# Altium project Earendel_Rules_Enabled_V2.PrjPcb
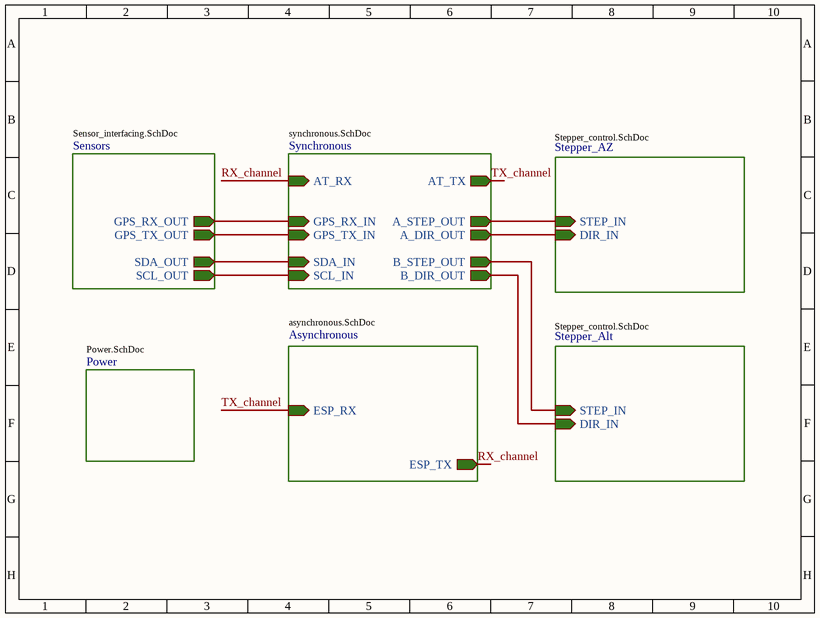
[diagram p0: Top_domain.SchDoc]
6 sheets, 53 parts. Net scope: hierarchical (ports join the sheet entries above them; power ports are global).
Board file: PCBmain.PcbDoc
Sheets:
  Top_domain.SchDoc
    Power = Power.SchDoc
    Synchronous = synchronous.SchDoc
    Asynchronous = asynchronous.SchDoc
    Sensors = Sensor_interfacing.SchDoc
    Stepper_AZ = Stepper_control.SchDoc
    Stepper_Alt = Stepper_control.SchDoc

## Sheet Top_domain.SchDoc
size 152 x 114 mm; SheetNumber: 1; SheetTotal: 5

### Sub-sheets
Asynchronous = asynchronous.SchDoc: ESP_RX (in), ESP_TX (out)
Power = Power.SchDoc: no entries
Sensors = Sensor_interfacing.SchDoc: GPS_RX_OUT (out), GPS_TX_OUT (out), SDA_OUT (out), SCL_OUT (out)
Stepper_Alt = Stepper_control.SchDoc: STEP_IN (in), DIR_IN (in)
Stepper_AZ = Stepper_control.SchDoc: STEP_IN (in), DIR_IN (in)
Synchronous = synchronous.SchDoc: AT_TX (out), AT_RX (in), GPS_RX_IN (in), GPS_TX_IN (in), SDA_IN (in), SCL_IN (in), A_STEP_OUT (out), B_STEP_OUT (out), A_DIR_OUT (out), B_DIR_OUT (out)

### Nets
RX_channel: sheet Synchronous/AT_RX, sheet Asynchronous/ESP_TX
SCL: sheet Synchronous/SCL_IN, sheet Sensors/SCL_OUT
SDA: sheet Synchronous/SDA_IN, sheet Sensors/SDA_OUT
TX_channel: sheet Synchronous/AT_TX, sheet Asynchronous/ESP_RX
NetP1_2: sheet Synchronous/GPS_TX_IN, sheet Sensors/GPS_TX_OUT
NetP1_3: sheet Synchronous/GPS_RX_IN, sheet Sensors/GPS_RX_OUT
NetP2A_7: sheet Synchronous/A_STEP_OUT, sheet Stepper_AZ/STEP_IN
NetP2A_8: sheet Synchronous/A_DIR_OUT, sheet Stepper_AZ/DIR_IN
NetP2B_7: sheet Synchronous/B_STEP_OUT, sheet Stepper_Alt/STEP_IN
NetP2B_8: sheet Synchronous/B_DIR_OUT, sheet Stepper_Alt/DIR_IN

## Sheet Power.SchDoc
size 114 x 152 mm; SheetNumber: 4; SheetTotal: 5
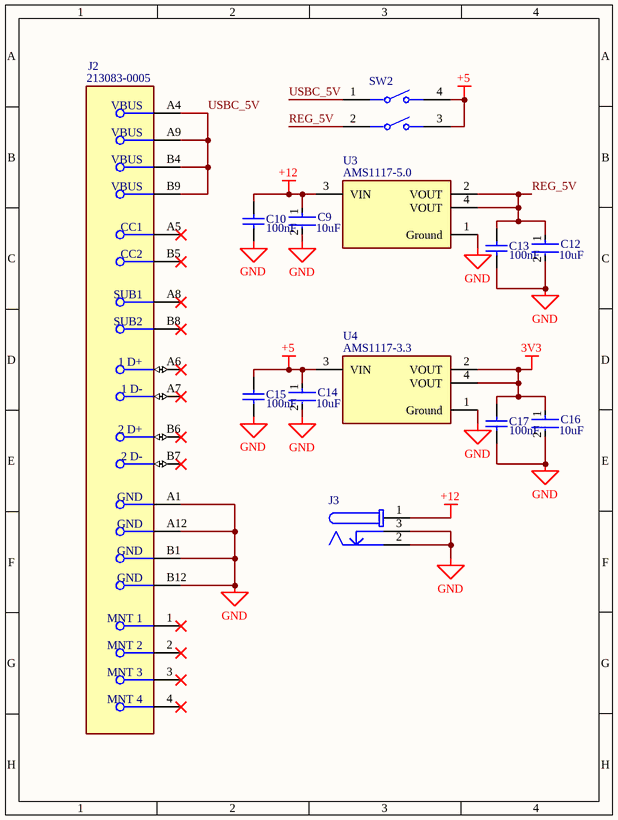
[diagram p1: Power.SchDoc]

### Parts
C9  Capacitance: 10uF  [FP-1206-L_3_2_0_2-W_1_6_0-IPC_B]  (hidden comment: 1206YD106KAT2A)
C10  value 100nF  [CAPC2013X140X50LL20T25]  (hidden comment: 08055F104KAT2A)
C12  Capacitance: 10uF  [FP-1206-L_3_2_0_2-W_1_6_0-IPC_B]  (hidden comment: 1206YD106KAT2A)
C13  value 100nF  [CAPC2013X140X50LL20T25]  (hidden comment: 08055F104KAT2A)
C14  Capacitance: 10uF  [FP-1206-L_3_2_0_2-W_1_6_0-IPC_B]  (hidden comment: 1206YD106KAT2A)
C15  value 100nF  [CAPC2013X140X50LL20T25]  (hidden comment: 08055F104KAT2A)
C16  Capacitance: 10uF  [FP-1206-L_3_2_0_2-W_1_6_0-IPC_B]  (hidden comment: 1206YD106KAT2A)
C17  value 100nF  [CAPC2013X140X50LL20T25]  (hidden comment: 08055F104KAT2A)
J2  213083-0005  [FP-2130830005-MFG]
J3  694106301002  [694106301002]  (value not drawn)
SW2  A6T-2104  [FP-A6T-2104-MFG]  (value not drawn)
U3  AMS1117-5.0  [FP-AMS1117-IPC_C]
U4  AMS1117-3.3  [FP-AMS1117-IPC_C]

### Nets
3V3: C16.1 C17.2 U4.2(VOUT) U4.4(VOUT)
+5: C14.1 C15.2 SW2.3 SW2.4 U4.3(VIN)
+12: C9.1 C10.2 J3.1 U3.3(VIN)
GND: C9.2 C10.1 C12.2 C13.1 C14.2 C15.1 C16.2 C17.1 J2.A1(GND) J2.A12(GND) J2.B1(GND) J2.B12(GND) J3.2 J3.3 U3.1(Ground) U4.1(Ground)
REG_5V: C12.1 C13.2 SW2.2 U3.2(VOUT) U3.4(VOUT)
USBC_5V: J2.A4(VBUS) J2.A9(VBUS) J2.B4(VBUS) J2.B9(VBUS) SW2.1

Not connected (* = marked no-connect by the designer): J2 1(MNT_1)* 2(MNT_2)* 3(MNT_3)* 4(MNT_4)* A5(CC1)* A6(1_D+)* A7(1_D-)* A8(SUB1)* B5(CC2)* B6(2_D+)* B7(2_D-)* B8(SUB2)*

### Library data of the parts
C9 C12 C14 C16 = CMP-04427-000082-1: General Purpose Ceramic Capacitor, 1206, 10uF, 10%, X5R, 15%, 16V; Max Operating Temperature: 85°C; Tolerance: 10%; Dielectric: X5R; Series: -; Case Code (Imperial): 1206; Width: 1.6mm; Termination: SMD/SMT; Voltage Rating: 16V; REACH SVHC: No SVHC; Length: 3.2mm; Size: 1.78mm; Package Quantity: 1; Voltage: 16V; RoHS Compliant: Yes; Thickness: 0.07inch; Mount: Surface Mount; Radiation Hardening: No; Voltage Rating (DC): 16V; Min Operating Temperature: -55°C; Case Code (Metric): 3216; Construction: Flat; Depth: 1.6mm; Height: 0.07mm; Lead Free: Lead Free; Number of Pins: 2; Case/Package: 1206; Packaging: Tape and Reel
C10 C13 C15 C17 = CMP-2007-04784-1: Manufacturer: AVX Interconnect / Elco; Part Number: 08055F104KAT2A
J2 = CMP-04767-000030-2: CONN RCP USB2.0 TYP C 24P SMD RA; NexarPartId: 114105384; Current Rating: 5A; Number of Contacts: 16; Voltage Rating: 30V; Gender: Receptacle; Min Operating Temperature: -40°C; USB Standard: USB 2.0; Max Operating Temperature: 85°C; Contact Material: Gold, Nickel; Schedule B: 8536695050, 8536695050; Country of Origin: CN
J3 = CMP-1502-00188-2: NexarPartId: 52676100; Voltage Rating (DC): 20V; Gender: Male; Voltage Rating: 24V; Connector Type: Power; Insulation Resistance: 100MΩ; Current Rating: 5A; Shielding: Unshielded; Number of Contacts: 3; Color: Black; Housing Material: Polyamide; Contact Gender: Female; REACH SVHC: Unknown; Termination: Through Hole; Height: 11mm; RoHS: Compliant; Mount: Through Hole; Flammability Rating: UL94 V-0; Packaging: Bulk; Min Operating Temperature: -40°C; Contact Plating: Tin; Max Operating Temperature: 85°C; Operating Supply Voltage: 24V; Contact Material: Gold, Tin
SW2 = CMP-08827-000029-1: SWITCH SLIDE DIP SPST 25MA 24V; Pitch: 0.1inch; Contact Resistance: 200mR; Electrical Life: 1000Cycles; Number of Circuits: 2; Washable: No; Actuator Length: 0.6mm; Actuator Type: Slide (Standard); Max Current Rating: 25mA; Termination: PC Pins; Mount: Through Hole; Max Operating Temperature: 70°C; Throw Configuration: SPST; Packaging: Rail/Tube; Contact Current Rating: 25mA; Current Rating: 25mA; Case/Package: DIP; Width: 6.2mm; Radiation Hardening: No; Lead Free: Lead Free; Series: A6T; Package Quantity: 76; Voltage Rating (DC): 24V; Min Operating Temperature: -20°C; Contact Plating: Gold; Number of Positions: 2; Orientation: Straight; RoHS Compliant: Yes; Terminal Pitch: 2.54mm; Weight: 0.26g; Length: 0.237inch; Max Voltage Rating (DC): 24V; Mechanical Life: 1000Cycles; Height: 4.2mm; Contact Material: Gold
U3 = CMP-209535-000001-1: LDO Voltage Regulators 1A, 3.3V; Manufacturer Part Number: AMS1117-3.3; Manufacturer: Advanced Monolithic Systems; Dropout Voltage: 1.1V; Output Type: Fixed; Nominal Supply Current: 5mA; Max Power Dissipation: 1.2W; Max Supply Voltage: 15V; Number Of Outputs: 1; Standoff Height: 0.64mm; Max Junction Temp: +125°C; Height: 1.8mm; Package: AMS1117; Device Class L2: Power Management ICs; ComponentLink2Description: Datasheet; ComponentLink2URL: http://www.advanced-monolithic.com/pdf/ds1117.pdf; Category: IC; RoHS: TRUE; Automotive: No; Device Class L1: Integrated Circuits (ICs); Output Current: 1A; Device Class L3: Voltage Regulators - Linear; Temperature: -40°C to +125°C; Output Voltage: 3.3V; Temperature Range Low: -40°C; Octopart: https://octopart.com/ams1117-3.3-advanced+monolithic+systems-25899300; Lead Free: Yes; Ipc Land Pattern Name: SOT229P700X180-4; Temperature Range High: +125°C
U4 = CMP-209535-000001-1: LDO Voltage Regulators 1A, 3.3V; Manufacturer: Advanced Monolithic Systems; Dropout Voltage: 1.1V; Output Type: Fixed; Nominal Supply Current: 5mA; Max Power Dissipation: 1.2W; Max Supply Voltage: 15V; Number Of Outputs: 1; Standoff Height: 0.64mm; Max Junction Temp: +125°C; Height: 1.8mm; Package: AMS1117; Device Class L2: Power Management ICs; ComponentLink2Description: Datasheet; ComponentLink2URL: http://www.advanced-monolithic.com/pdf/ds1117.pdf; Category: IC; RoHS: TRUE; Automotive: No; Device Class L1: Integrated Circuits (ICs); Output Current: 1A; Device Class L3: Voltage Regulators - Linear; Temperature: -40°C to +125°C; Output Voltage: 3.3V; Manufacturer Part Number: AMS1117-3.3; Temperature Range Low: -40°C; Octopart: https://octopart.com/ams1117-3.3-advanced+monolithic+systems-25899300; Lead Free: Yes; Ipc Land Pattern Name: SOT229P700X180-4; Temperature Range High: +125°C

## Sheet synchronous.SchDoc
size 127 x 127 mm; SheetNumber: 3; SheetTotal: 5
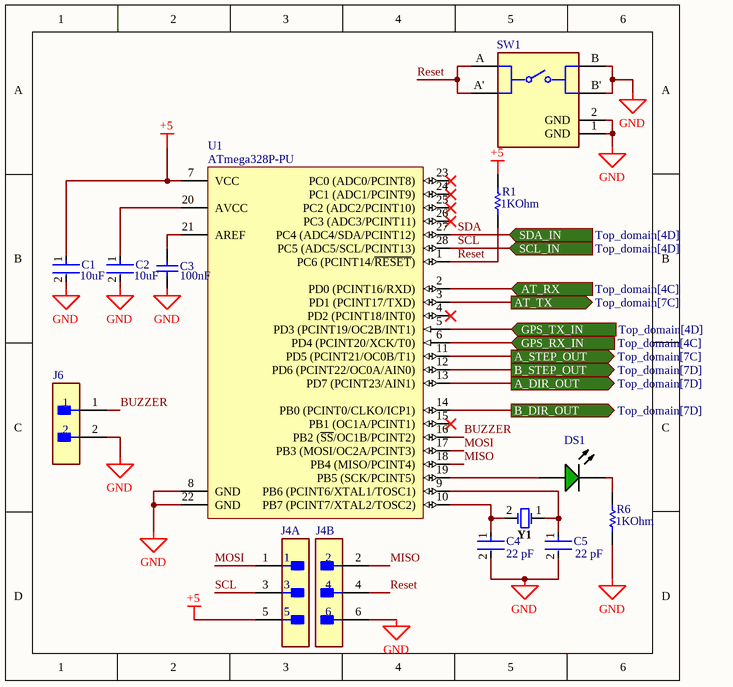
[diagram p2: synchronous.SchDoc]

### Parts
C1  Capacitance: 10uF  [FP-1206-L_3_2_0_2-W_1_6_0-IPC_B]  (hidden comment: 1206YD106KAT2A)
C2  Capacitance: 10uF  [FP-1206-L_3_2_0_2-W_1_6_0-IPC_B]  (hidden comment: 1206YD106KAT2A)
C3  value 100nF  [CAPC2013X140X50LL20T25]  (hidden comment: 08055F104KAT2A)
C4  Capacitance: 22 pF  [FP-C0805C-DN-MFG]  (hidden comment: C0805C220K3GACTU)
C5  Capacitance: 22 pF  [FP-C0805C-DN-MFG]  (hidden comment: C0805C220K3GACTU)
DS1  HSMG-C170  [AVAG-HSMX-C170_V]  (value not drawn)
J4  M20-9980346  [FP-M20-9980346-MFG]  (value not drawn)  (parts A,B of 2)
J6  B2B-XH-A(LF)(SN)  [FP-B2B-XH-A_LF_SN-MFG]  (value not drawn)
R1  Resistance: 1KOhm  [RESC2013X60X35ML10T20]  (hidden comment: RC0805FR-071KL)
R6  Resistance: 1KOhm  [RESC2013X60X35ML10T20]  (hidden comment: RC0805FR-071KL)
SW1  EVQ-PLMA15  [FP-EVQ-PLMA15-MFG]  (value not drawn)
U1  ATmega328P-PU  [28P3]
Y1  FOXSLF/160-20  [FOX-FOXSLF160-20]  (value not drawn)

### Ports
A_DIR_OUT (out, see Top_domain[7D]), A_STEP_OUT (out, see Top_domain[7C]), AT_RX (in, see Top_domain[4C]), AT_TX (out, see Top_domain[7C]), B_DIR_OUT (out, see Top_domain[7D]), B_STEP_OUT (out, see Top_domain[7D]), GPS_RX_IN (in, see Top_domain[4C]), GPS_TX_IN (in, see Top_domain[4D]), SCL_IN (in, see Top_domain[4D]), SDA_IN (in, see Top_domain[4D])

### Nets
+5: C1.1 J4.5 R1.2 U1.7(VCC)
GND: C1.2 C2.2 C3.1 C4.2 C5.2 J4.6 J6.2 R6.1 SW1.1(GND) SW1.2(GND) SW1.B SW1.B' U1.8(GND) U1.22(GND)
BUZZER: J6.1 U1.16(PB2_(~{SS}/OC1B/PCINT2))
MISO: J4.2 U1.18(PB4_(MISO/PCINT4))
MOSI: J4.1 U1.17(PB3_(MOSI/OC2A/PCINT3))
Reset: J4.4 R1.1 SW1.A SW1.A' U1.1(PC6_(PCINT14/~{RESET}))
RX_channel: U1.2(PD0_(PCINT16/RXD)) ; port AT_RX
SCL: J4.3 U1.28(PC5_(ADC5/SCL/PCINT13)) ; port SCL_IN
SDA: U1.27(PC4_(ADC4/SDA/PCINT12)) ; port SDA_IN
TX_channel: U1.3(PD1_(PCINT17/TXD)) ; port AT_TX
NetC2_1: C2.1 U1.20(AVCC)
NetC3_2: C3.2 U1.21(AREF)
NetC4_1: C4.1 U1.10(PB7_(PCINT7/XTAL2/TOSC2)) Y1.2
NetC5_1: C5.1 U1.9(PB6_(PCINT6/XTAL1/TOSC1)) Y1.1
NetDS1_1: DS1.1(A) U1.19(PB5_(SCK/PCINT5))
NetDS1_2: DS1.2(K) R6.2
NetP1_2: U1.5(PD3_(PCINT19/OC2B/INT1)) ; port GPS_TX_IN
NetP1_3: U1.6(PD4_(PCINT20/XCK/T0)) ; port GPS_RX_IN
NetP2A_7: U1.11(PD5_(PCINT21/OC0B/T1)) ; port A_STEP_OUT
NetP2A_8: U1.13(PD7_(PCINT23/AIN1)) ; port A_DIR_OUT
NetP2B_7: U1.12(PD6_(PCINT22/OC0A/AIN0)) ; port B_STEP_OUT
NetP2B_8: U1.14(PB0_(PCINT0/CLKO/ICP1)) ; port B_DIR_OUT

Not connected (* = marked no-connect by the designer): U1 4(PD2_(PCINT18/INT0))* 15(PB1_(OC1A/PCINT1))* 23(PC0_(ADC0/PCINT8))* 24(PC1_(ADC1/PCINT9))* 25(PC2_(ADC2/PCINT10))* 26(PC3_(ADC3/PCINT11))*

### Library data of the parts
C1 C2 = CMP-04427-000082-1: as C9 on sheet Power; Max Operating Temperature: 85°C; Tolerance: 10%; Dielectric: X5R; Series: -; Case Code (Imperial): 1206; Width: 1.6mm; Termination: SMD/SMT; Voltage Rating: 16V; REACH SVHC: No SVHC; Length: 3.2mm; Size: 1.78mm; Package Quantity: 1; Voltage: 16V; RoHS Compliant: Yes; Thickness: 0.07inch; Mount: Surface Mount; Radiation Hardening: No; Voltage Rating (DC): 16V; Min Operating Temperature: -55°C; Case Code (Metric): 3216; Construction: Flat; Depth: 1.6mm; Height: 0.07mm; Lead Free: Lead Free; Number of Pins: 2; Case/Package: 1206; Packaging: Tape and Reel
C3 = CMP-2007-04784-1: Manufacturer: AVX Interconnect / Elco; Part Number: 08055F104KAT2A
C4 C5 = CMP-2007-00528-2: CAP CER 22PF 25V 10% NP0 0805; Manufacturer: KEMET; Temperature Coefficient: 30ppm/°C; Temperature Characteristic: C0G; Material: Ceramic; Tolerance: 0.1; Temperature Range High: +125°C; Value: 22 pF; Temperature Range Low: -55°C; Category: Cap; Manufacturer Part Number: C0805C220K3GACTU; Automotive: No; Lead Free: Yes; Voltage Rating: 25 V; ComponentLink2URL: https://content.kemet.com/datasheets/KEM_C1003_C0G_SMD.pdf; Package: C0805C-DN; ComponentLink2Description: Datasheet; Device Class L2: Capacitors; RoHS: TRUE; Height: 0.88mm; Device Class L3: Ceramic Capacitors; Octopart: https://octopart.com/c0805c220k3gactu-kemet-12580612; Digikey Description: CAP CER 22PF 25V 10% NP0 0805; Temperature: -55°C to +125°C; Device Class L1: Passive Components; Ipc Land Pattern Name: CAPC200125X78; Mouser Description: Multilayer Ceramic Capacitors MLCC - SMD/SMT 25volts 22pF C0G 10%
DS1 = CMP-2000-05062-1: Chip LED, Green, 2.2 V, -40 to 85 degC, 2-Pin SMD, Pb-Free, Tape and Reel; Manufacturer: Avago; No. of Pins: 2; Peak Wavelength: 570nm; SVHC: NoSVHC(16-Jun-2014); Dominant Wavelength: 572nm; Forward Current If: 20mA; Viewing Angle: 170deg; Lens Shape: Rectangular; PIV Max: 5V; External Width: 1.25mm; LED Type: Standard; External Depth: 0.8mm; Opto Mounting Orientation: Top; Luminous Intensity: 15mcd; Luminous Intensity Min: 4mcd; Forward Voltage VF Max: 2.6V; External Length / Height: 2mm; Bulb Size: 1.25mmx1.4mm; Light Area Height: 1mm; Voltage Vf Typ: 2.2V; Operating Temperature Max: 85degC; Datasheet Version: Oct-08; MSL: MSL2A-4weeks; Peak Forward Current: 20mA; Package Description: 2-Pin Surface Mount Device, Body 2 x 1.25 mm, Height 0.8 mm; Datasheet URL: https://datasheet.ciiva.com/29280/180495-da-01-en-chip-led-hsmg-c170-gelb-gruen-29280971.pdf; Storage Temperature Min: -40degC; LED Colour: Green; Wavelength Typ: 570nm; Mounting Type: SMD; Forward Current If Max: 20mA; Dominant Wavelength Typ: 572nm; LED Mounting: SMD; Operating Temperature Range: -30degCto+85degC; Operating Temperature Min: -30degC; Manufacturer URL: http://www.avagotech.com/; Packaging: CutTape; Luminous Intensity Typ: 15mcd; Package Reference: HSMX-C170; Storage Temperature Max: 85degC; Opto Case Style: SMD; Forward Voltage: 2.2V
J4 = CMP-2000-06636-2: CONN HEADER VERT 6POS 2.54MM; Manufacturer: Harwin; Current Rating: 3A; Number Of Contacts: 6; Conn Gender: Male; Conn Orientation: Vertical; Device Class L1: Connectors; ComponentLink2Description: Datasheet; Height: 8.99mm; Temperature Range High: +105°C; Contact Material: Tin,Nickel; RoHS: TRUE; Temperature Range Low: -40°C; ComponentLink2URL: https://cdn.harwin.com/pdfs/M20-998.pdf; Digikey Description: CONN HEADER VERT 6POS 2.54MM; Pitch: 2.54mm; Package: M20-9980346; Device Class L2: Headers and Wire Housings; Manufacturer Part Number: M20-9980346; Number Of Rows: 2; Category: Conn; Lead Free: Yes; Mouser Description: 2.54mm (0.1") Pitch DIL Vertical PC Tail Pin Header, 6.1mm mating pin height, tin, 3+3 contacts; Temperature: -40°C to +105°C; Device Class L3: unset; Octopart: https://octopart.com/m20-9980346-harwin-5436545; Automotive: No
J6 = CMP-2000-05888-3: CONN HEADER VERT 2POS 2.5MM; Current Rating: 3A; Voltage Rating: 250V; Number of Contacts: 2; Contact Resistance: 20mR; Wire/Cable Gauge: 22AWG; Insulation Resistance: 1GR; Connector Type: Male Pin; Packaging: Bulk; Contact Material: Brass; Lead Free: Lead Free; Orientation: Straight; Contact Plating: Tin; Max Current Rating: 3A; Termination: Solder; Fastening Type: Detent; Depth: 5.75mm; Housing Material: Polyamide; REACH SVHC: No SVHC; Series: XH; Voltage Rating (AC): 250V; Number of Positions: 2; Color: Natural; Contact Type: Male Pin; Max Voltage Rating (DC): 250V; Pitch: 2.5mm; Lead Pitch: 2.5mm; Mount: Through Hole; Max Operating Temperature: 85°C; Length: 7.4mm; Max Voltage Rating (AC): 250V; Min Operating Temperature: -25°C; Number of Rows: 1; Housing Color: White
R1 R6 = CMP-2100-03671-1: Chip Resistor, 1 KOhm, +/- 1%, 125 mW, -55 to 155 degC, 0805 (2012 Metric), RoHS, Tape and Reel; Manufacturer: Yageo; Temperature Coefficient: 100ppm/degreesC; Voltage Rating (DC): 150V; Max Power Dissipation: 125mW; Number of Pins: 2; Number of Terminations: 2; Datasheet URL: http://www.yageo.com/NewPortal/yageodocoutput?fileName=/pdf/R-Chip/PYu-RC_Group_51_RoHS_L_5.pdf; Length: 0.079inch; Package Description: 2-Pin Surface Mounted Device, Body 2 x 1.25 mm; Depth: 1.25mm; Height: 0.024inch; Military Standard: Not; Case/Package: 0805; Package Reference: 0805; RoHSCompliant: true; Lead Free: LeadFree; Packaging: TapeandReel; Package Quantity: 1; Datasheet Version: Rev. 5, 10/2016; Tolerance: 1%; Min Operating Temperature: -55degC; Voltage Rating: 150V; Composition: ThickFilm; Case Code (Imperial): 0805; Power Rating: 125mW; Width: 0.049inch; Case Code (Metric): 2012; Manufacturer URL: http://www.yageo.com/; Max Operating Temperature: 155degC; REACH SVHC: Unknown; Termination: SMD/SMT
SW1 = CMP-05618-000006-1: SWITCH TACTILE SPST-NO 0.02A 15V; Manufacturer: Panasonic Electronic Components; Operating Force: 2.6N; Contact Resistance: 50mΩ; Contact Current Rating: 20mA; Electromechanical Life: 200000Cycles; Throw Configuration: SPST-NO; Automotive: No; Digikey Description: SWITCH TACTILE SPST-NO 0.02A 15V; Device Class L3: Tactile Switches; Device Class L2: Switches; Temperature Range Low: -20°C; ComponentLink2Description: Datasheet; RoHS: TRUE; Mount: Surface Mount; Package: 0; Height: 1.7mm; Octopart: https://octopart.com/evq-plma15-panasonic-39850235; Temperature Range High: +70°C; Device Class L1: Electromechanical; Category: Switch; Mouser Description: Tactile Switches FLAT ACT 2.6NF 4.6x3.4x1.5mm; Voltage Rating Dc: 15V; Manufacturer Part Number: EVQ-PLMA15; ComponentLink2URL: https://datasheet.ciiva.com/8164/atv0000ce2-8164994.pdf; Lead Free: Yes; Temperature: -20°C to +70°C
U1 = CMP-0095-00013-2: 8-bit AVR Microcontroller, 32KB Flash, 1KB EEPROM, 2KB SRAM, 28-pin PDIP, Industrial Grade (-40°C to 85°C); RevisionNote: DatasheetVersion updated. URLs added.; PackageVersion: revB, Sep-2001; PackageDescription: 28-lead (0.300"/7.62mm Wide) Plastic Dual Inline Package (PDIP); DatasheetVersion: revD, May-2011; ComponentLink1Description: Manufacturer URL; ComponentLink1URL: http://www.atmel.com/; PackageReference: 28P3; ComponentLink2Description: ATmega48A/48PA/88A/88PA/168A/168PA/328/328P Datasheet; ComponentLink3URL: http://www.atmel.com/dyn/resources/prod_documents/8271S.pdf; ComponentLink2URL: http://www.atmel.com/dyn/resources/prod_documents/8271.pdf; ComponentLink3Description: ATmega48A/48PA/88A/88PA/168A/168PA/328/328P Summary
Y1 = CMP-1749-00003-1: Resistance Weld Thru-Hole Crystal, 16 MHz, -20 to 70 degC, 2-Pin THD, RoHS, Bulk; Voltage Rating: 250 V; Tolerance: 1%; Resistance: 221 kohm; Case\Package: Axial; Power Rating: 250 mW; RoHSCompliant: true; Package Quantity: 200; Packaging: Bulk; Min Operating Temperature: -55 degC; DatasheetVersion: Mar-15; ComponentLink1URL: http://www.foxonline.com/; Max Operating Temperature: 155 degC; PackageReference: FOXSLF160-20; Mount: Through Hole; PackageDescription: 2-Pin Through Hole Device, Body 11.35 x 4.65 mm; ComponentLink1Description: Manufacturer URL; ComponentLink2URL: http://www.foxonline.com/pdfs/hc49slf.pdf; ComponentLink2Description: Datasheet; Length: 0.248 inch

## Sheet asynchronous.SchDoc
size 152 x 127 mm; SheetNumber: 5; SheetTotal: 6
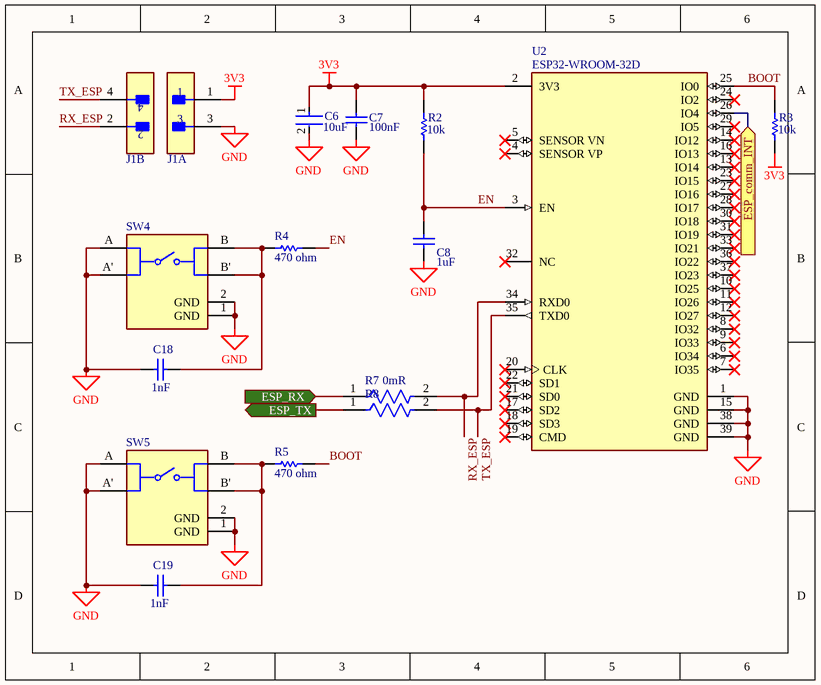
[diagram p3: asynchronous.SchDoc]

### Parts
C6  Capacitance: 10uF  [FP-1206-L_3_2_0_2-W_1_6_0-IPC_B]  (hidden comment: 1206YD106KAT2A)
C7  value 100nF  [CAPC2013X140X50LL20T25]  (hidden comment: 08055F104KAT2A)
C8  Parameter 1: 1uF  [CAPC2013X145X50LL20T25]  (hidden comment: C0805C105K4PACTU)
C18  Parameter 1: 1nF  [CAPC2013X145X48LL20T23]  (hidden comment: VJ0805D102KXAAJ)
C19  Parameter 1: 1nF  [CAPC2013X145X48LL20T23]  (hidden comment: VJ0805D102KXAAJ)
J1  PEC02DABN  [FP-PEC02DABN-MFG]  (value not drawn)  (parts A,B of 2)
R2  Parameter 1: 10k  [RESC2013X60X35NL10T20]  (hidden comment: RC0805FR-0710KL)
R3  Parameter 1: 10k  [RESC2013X60X35NL10T20]  (hidden comment: RC0805FR-0710KL)
R4  Parameter 1: 470 ohm  [RESC2013X50X30LL20T20]  (hidden comment: CRCW0805470RFKEA)
R5  Parameter 1: 470 ohm  [RESC2013X50X30LL20T20]  (hidden comment: CRCW0805470RFKEA)
R7  Resistance: 0mR  [FP-CR0805-IPC_C]  (hidden comment: CR0805-J/-000ELF)
R8  CR0805-J/-000ELF  [FP-CR0805-IPC_C]  (value not drawn)
SW4  EVQ-PLMA15  [FP-EVQ-PLMA15-MFG]  (value not drawn)
SW5  EVQ-PLMA15  [FP-EVQ-PLMA15-MFG]  (value not drawn)
U2  ESP32-WROOM-32D  [FP-ESP32-WROOM-32D-MFG]

### Ports
ESP_comm_INT (in), ESP_RX (in, see Top_domain[4F]), ESP_TX (out, see Top_domain[6G])

### Nets
3V3: C6.1 C7.2 J1.1 R2.2 R3.1 U2.2(3V3)
GND: C6.2 C7.1 C8.1 C18.1 C19.1 J1.3 SW4.1(GND) SW4.2(GND) SW4.A SW4.A' SW5.1(GND) SW5.2(GND) SW5.A SW5.A' U2.1(GND) U2.15(GND) U2.38(GND) U2.39(GND)
BOOT: R3.2 R5.2 U2.25(IO0)
EN: C8.2 R2.1 R4.2 U2.3(EN)
RX_channel: R8.1 ; port ESP_TX
RX_ESP: J1.2 R7.2 U2.34(RXD0)
TX_channel: R7.1 ; port ESP_RX
TX_ESP: J1.4 R8.2 U2.35(TXD0)
NetC18_2: C18.2 R4.1 SW4.B SW4.B'
NetC19_2: C19.2 R5.1 SW5.B SW5.B'
NetU2_26: U2.26(IO4) ; port ESP_comm_INT

Not connected (* = marked no-connect by the designer): U2 4(SENSOR_VP)* 5(SENSOR_VN)* 6(IO34)* 7(IO35)* 8(IO32)* 9(IO33)* 10(IO25)* 11(IO26)* 12(IO27)* 13(IO14)* 14(IO12)* 16(IO13)* 17(SD2)* 18(SD3)* 19(CMD)* 20(CLK)* 21(SD0)* 22(SD1)* 23(IO15)* 24(IO2)* 27(IO16)* 28(IO17)* 29(IO5)* 30(IO18)* 31(IO19)* 32(NC)* 33(IO21)* 36(IO22)* 37(IO23)*

### Library data of the parts
C6 = CMP-04427-000082-1: as C9 on sheet Power; Max Operating Temperature: 85°C; Tolerance: 10%; Dielectric: X5R; Series: -; Case Code (Imperial): 1206; Width: 1.6mm; Termination: SMD/SMT; Voltage Rating: 16V; REACH SVHC: No SVHC; Length: 3.2mm; Size: 1.78mm; Package Quantity: 1; Voltage: 16V; RoHS Compliant: Yes; Thickness: 0.07inch; Mount: Surface Mount; Radiation Hardening: No; Voltage Rating (DC): 16V; Min Operating Temperature: -55°C; Case Code (Metric): 3216; Construction: Flat; Depth: 1.6mm; Height: 0.07mm; Lead Free: Lead Free; Number of Pins: 2; Case/Package: 1206; Packaging: Tape and Reel
C7 = CMP-2007-04784-1: Manufacturer: AVX Interconnect / Elco; Part Number: 08055F104KAT2A
C8 = CMP-1036-04746-2: Manufacturer: Kemet; Part Number: C0805C105K4PACTU
C18 C19 = CMP-2007-03135-1: Manufacturer: Vitramon; Part Number: VJ0805D102KXAAJ
J1 = CMP-25680-000069-1: CONN HEADER VERT 4POS 2.54MM; Number of Contacts: 4; Row Spacing: 0.1inch; Connector Type: Male Pin; Gender: Male; Series: -; Housing Material: Plastic; Contact Material: Bronze; Length: 5.08mm; RoHS Compliant: Yes; Width: 5.08mm; Min Operating Temperature: -65°C; Contact Shape: Square; Pitch: 0.1inch; Lead Free: Lead Free; Number of Positions: 4; Fastening Type: Pull; Contact Plating: Tin; Flammability Rating: UL94 V-0; Packaging: Bulk; Termination: Solder; Max Operating Temperature: 125°C; Package Quantity: 1; Number of Rows: 2; Contact Mating Length: 0.23inch; Contact Finish - Mating: TIN; Height: 2.54mm; Insulation Color: Black; Mount: Through Hole; Insulation Material: PBT; Color: Black; Housing Color: Black; Contact Type: Male Pin
R2 R3 = CMP-1659-00013-4: Chip Resistor, 10 KOhm, +/- 1%, 0.125 W, -55 to 155 degC, 0805 (2012 Metric), RoHS, Tape and Reel; Manufacturer: Yageo; Voltage Rating: 150 V; Mount: Surface Mount; ComponentLink1Description: Manufacturer URL; ComponentLink2URL: http://www.yageo.com/documents/recent/PYu-RC_Group_51_RoHS_L_04.pdf; Pins: 2; Length: 2 mm; Min Operating Temperature: -55 degC; Height: 0.5 mm; Mounting Technology: Surface Mount; RoHSCompliant: true; REACH SVHC: No SVHC; ComponentLink1URL: http://www.yageo.com/; Max Operating Temperature: 155 degC; PackageReference: 0805; DatasheetVersion: Rev. 4, 02/2016; Package Quantity: 5000; Packaging: Tape and Reel; ComponentLink2Description: Datasheet; PackageDescription: 2-Pin Surface Mounted Device, Body 2 x 1.25 mm
R4 R5 = CMP-2001-03932-1: Manufacturer: Vishay Dale; Part Number: CRCW0805470RFKEA
R7 = CMP-07231-004348-1: Thick Film Chip Resistors 0805 0Ω 0.125W 5%; Voltage Rating: 150V; Max Power Dissipation: 125mW; Temperature Coefficient: 500ppm/°C; Min Operating Temperature: -55°C; Case Code (Metric): 2012; Height: 0.5mm; Contact Plating: Tin; Thickness: 508um; Military Standard: Not; Composition: Thick Film; REACH SVHC: No SVHC; Voltage Rating (DC): 150V; Length: 2mm; Radiation Hardening: No; Case/Package: 0805; Package Quantity: 5000; Number of Pins: 2; Max Operating Temperature: 155°C; Case Code (Imperial): 0805; Mount: Surface Mount; Depth: 1.25mm; Packaging: Tape and Reel; Tolerance: 5%; Termination: SMD/SMT; Width: 1.25mm; Power Rating: 125mW
R8 = CMP-07231-004348-1: Thick Film Chip Resistors 0805 0Ω 0.125W 5%; Voltage Rating: 150V; Max Power Dissipation: 125mW; Temperature Coefficient: 500ppm/°C; Resistance: 0mR; Min Operating Temperature: -55°C; Case Code (Metric): 2012; Height: 0.5mm; Contact Plating: Tin; Thickness: 508um; Military Standard: Not; Composition: Thick Film; REACH SVHC: No SVHC; Voltage Rating (DC): 150V; Length: 2mm; Radiation Hardening: No; Case/Package: 0805; Package Quantity: 5000; Number of Pins: 2; Max Operating Temperature: 155°C; Case Code (Imperial): 0805; Mount: Surface Mount; Depth: 1.25mm; Packaging: Tape and Reel; Tolerance: 5%; Termination: SMD/SMT; Width: 1.25mm; Power Rating: 125mW
SW4 SW5 = CMP-05618-000006-1: as SW1 on sheet synchronous; Throw Configuration: SPST-NO; Automotive: No; Digikey Description: SWITCH TACTILE SPST-NO 0.02A 15V; Device Class L3: Tactile Switches; Device Class L2: Switches; Temperature Range Low: -20°C; ComponentLink2Description: Datasheet; RoHS: TRUE; Mount: Surface Mount; Package: 0; Height: 1.7mm; Octopart: https://octopart.com/evq-plma15-panasonic-39850235; Temperature Range High: +70°C; Device Class L1: Electromechanical; Category: Switch; Mouser Description: Tactile Switches FLAT ACT 2.6NF 4.6x3.4x1.5mm; Voltage Rating Dc: 15V; Manufacturer Part Number: EVQ-PLMA15; ComponentLink2URL: https://datasheet.ciiva.com/8164/atv0000ce2-8164994.pdf; Lead Free: Yes; Temperature: -20°C to +70°C
U2 = CMP-194065-000003-1: WIFI MODULE 32MBITS SPI FLASH; Manufacturer: Espressif Systems; Max Supply Voltage: 3.6V; Nominal Supply Current: 500mA; Max Frequency: 2484MHz; Number Of Adc Channels: 16; Number Of Gpio: 32; Interface: I2C,SPI,UART,Ethernet,I2S,Other; Data Rate: 150Mbits/s; Min Supply Voltage: 3V; Bandwidth: 72MHz; Sensitivity: -98dBm; Octopart: https://octopart.com/esp32-wroom-32d-espressif+systems-91040050; Package: ESP32-WROOM-32D; ComponentLink2URL: https://www.espressif.com/sites/default/files/documentation/esp32-wroom-32d_esp32-wroom-32u_datasheet_en.pdf; Lead Free: Yes; Category: UNK; Mouser Description: Wi-Fi/BT BLE Module ESP32-D0WD, SPI Flash, UART, P; Device Class L1: Integrated Circuits (ICs); RoHS: TRUE; Temperature Range Low: -40°C; ComponentLink2Description: Datasheet; Digikey Description: WIFI MODULE 32MBITS SPI FLASH; Height: 3.2mm; Temperature: -40°C to +85°C; Manufacturer Part Number: ESP32-WROOM-32D; Device Class L3: Transceivers; Device Class L2: RF Semiconductors and Devices; Temperature Range High: +85°C; Automotive: No

## Sheet Sensor_interfacing.SchDoc
size 76 x 76 mm; SheetNumber: 5; SheetTotal: 5
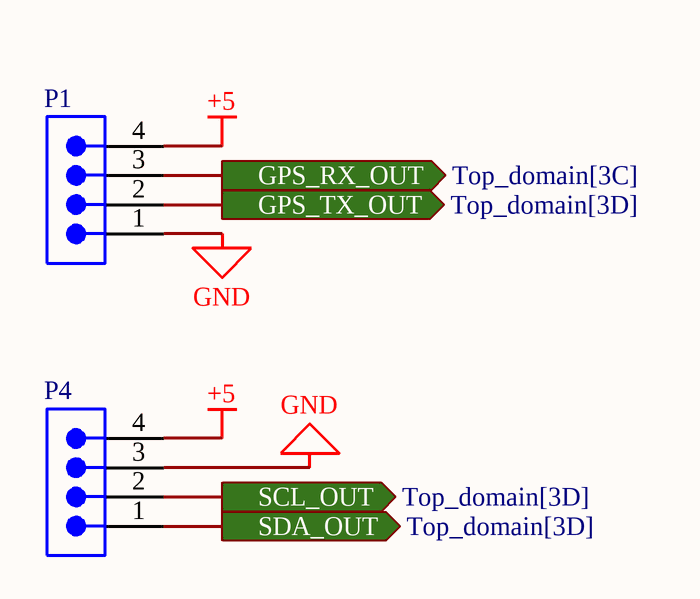
[diagram p4: Sensor_interfacing.SchDoc]

### Parts
P1  61300411121  [61300411121]  (value not drawn)
P4  61300411121  [61300411121]  (value not drawn)

### Ports
GPS_RX_OUT (out, see Top_domain[3C]), GPS_TX_OUT (out, see Top_domain[3D]), SCL_OUT (out, see Top_domain[3D]), SDA_OUT (out, see Top_domain[3D])

### Nets
+5: P1.4 P4.4
GND: P1.1 P4.3
SCL: P4.2 ; port SCL_OUT
SDA: P4.1 ; port SDA_OUT
NetP1_2: P1.2 ; port GPS_TX_OUT
NetP1_3: P1.3 ; port GPS_RX_OUT

### Library data of the parts
P1 P4 = CMP-1502-01064-2: NexarPartId: 32855522; Pitch: 2.54mm; Number of Contacts: 4; Contact Resistance: 20mΩ; Gender: Male; Current Rating: 3A; Connector Type: Male Pin; Voltage Rating: 250V; Lead Free: Lead Free; Contact Plating: Gold; Max Operating Temperature: 105°C; Packaging: Bulk; Height: 8.89mm; Orientation: Vertical; Contact Mating Length: 5.9944mm; Contact Material: Copper; Lead Pitch: 2.54mm; Min Operating Temperature: -40°C; Termination: Solder; Color: Black; Number of Rows: 1; REACH SVHC: Unknown; RoHS: Compliant; Mount: Through Hole; Number of Positions: 4; Number of Pins: 4; Operating Supply Voltage: 250V

## Sheet Stepper_control.SchDoc
size 139 x 101 mm; SheetNumber: 2; SheetTotal: 6
Used 2 times, as channels Stepper_AZ, Stepper_Alt. Parts and nets are listed once, with the designators drawn on the sheet.
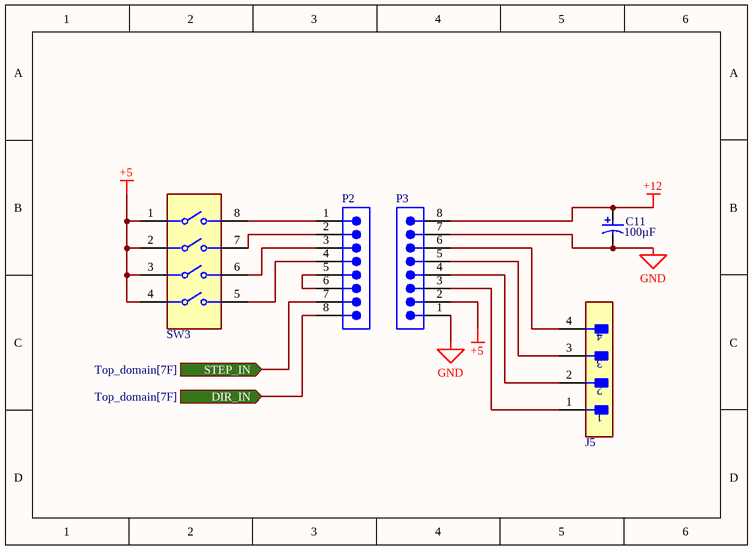
[diagram p5: Stepper_control.SchDoc]

### Parts
C11  Capacitance: 100µF  [PNSC-FK-V-D8_V]  (hidden comment: EEEFK1E101XP)
J5  B4B-XH-A(LF)(SN)  [FP-B4B-XH-A_LF_SN-MFG]  (value not drawn)
P2  61300811121  [61300811121]  (value not drawn)
P3  61300811121  [61300811121]  (value not drawn)
SW3  1825360-3  [FP-1825360-3-MFG]  (value not drawn)

### Ports
DIR_IN (in, see Top_domain[7F]), STEP_IN (in, see Top_domain[7F])

### Nets
+5: P3.2 SW3.1 SW3.2 SW3.3 SW3.4
+12: C11.1 P3.8
GND: C11.2 P3.1 P3.7
DIR_IN: P2.8 ; port DIR_IN
STEP_IN: P2.7 ; port STEP_IN
NetJ5_1: J5.1 P3.3
NetJ5_2: J5.2 P3.4
NetJ5_3: J5.3 P3.5
NetJ5_4: J5.4 P3.6
NetP2_1: P2.1 SW3.8
NetP2_2: P2.2 SW3.7
NetP2_3: P2.3 SW3.6
NetP2_4: P2.4 SW3.5
NetP2_5: P2.5 P2.6

### Channels
Stepper_AZ: designators end in A; ports DIR_IN=NetP2A_8 STEP_IN=NetP2A_7
Stepper_Alt: designators end in B; ports DIR_IN=NetP2B_8 STEP_IN=NetP2B_7

### Library data of the parts
C11 = CMP-2000-06206-1: Aluminum Electrolytic Capacitor, 100 uF, +/- 20%, 25 V, 2-Pin SMD (Size Code D8), -55 to 105 degC, RoHS, Tape and Reel; Manufacturer: Panasonic; Type: Can; Lifetime@Temperature: 2000Hrs@105°C; Rated Voltage: 25V; Ripple Current: 280mA; Impedance: 0.34O; Case Size/Dimension: Ø6.3x7.7mm; Operating Temp-Max: 105°C; Series: FK; Package URL: http://industrial.panasonic.com/cdbs/www-data/pdf/RDE0000/DME0000COL48.pdf; Mounting Technology: SurfaceMount; Package Description: 2-Pin Electrolytic Aluminum Capacitor, Body 6.6 x 6.6 mm; Datasheet Version: 03/2016; Datasheet URL: http://industrial.panasonic.com/cdbs/www-data/pdf/RDE0000/ABA0000C1181.pdf; Manufacturer URL: http://www.panasonic.com/; Package Reference: FK-V-D8; Operating Temp Range: -55to+105°C
J5 = CMP-17439-000250-1: CONN HEADER VERT 4POS 2.5MM; Number of Contacts: 4; Contact Resistance: 20mR; Voltage Rating: 250V; Max Current Rating: 3A; Gender: Male; Wire/Cable Gauge: 22AWG; Mated Stacking Heights: 9.8mm; Insulation Resistance: 1GR; Orientation: Straight; Contact Type: Male Pin; Contact Finish - Mating: TIN; Series: XH; Max Voltage Rating (AC): 250V; Lead Pitch: 2.5mm; Contact Shape: Square; Insulation Color: Natural; Termination: Solder; Lead Free: Lead Free; Voltage Rating (AC): 250V; Number of Rows: 1; Flammability Rating: UL94 V-0; Number of Positions: 4; Max Operating Temperature: 85°C; Package Quantity: 500; Mount: Through Hole; REACH SVHC: No SVHC; Connector Type: Header; Insulation Material: Nylon; Fastening Type: Detent; Min Operating Temperature: -25°C; Housing Color: White; Packaging: Bulk; Contact Plating: Tin; Contact Material: Brass; Max Voltage Rating (DC): 250V; Housing Material: Polyamide; Color: Natural; Material: Polyamide; Pitch: 2.5mm; Depth: 5.75mm; Current Rating: 3A; Length: 12.4mm
P2 P3 = CMP-1502-01076-2: NexarPartId: 32855533; Current Rating: 3A; Connector Type: Male Pin; Voltage Rating: 250V; Number of Contacts: 8; Pitch: 2.54mm; Contact Resistance: 20mΩ; Gender: Male; REACH SVHC: Unknown; Number of Rows: 1; Mount: Through Hole; Termination: Solder; Number of Pins: 8; Number of Positions: 8; Height: 8.54mm; Contact Mating Length: 5.9944mm; Orientation: Vertical; Operating Supply Voltage: 250V; Min Operating Temperature: -40°C; Max Operating Temperature: 105°C; Packaging: Bulk; Color: Black; Lead Pitch: 2.54mm; RoHS: Compliant; Contact Material: Copper; Contact Plating: Gold
SW3 = CMP-03400-000022-1: SWITCH SLIDE DIP SPST 100MA 24V; Washable: Yes; Contact Current Rating: 1A; Electrical Life: 1000Cycles; Number of Circuits: 4; Pitch: 0.1inch; Actuator Length: 0.99mm; Contact Resistance: 50mR; Actuator Type: Standard; Contact Post Length: 4mm; Voltage Rating (DC): 5V; Actuator Material: Polybutylene; Sealable: No (Without); Max Voltage Rating (DC): 24V; Throw Configuration: SPST; Mount: Through Hole; Type: Switch; RoHS Compliant: Yes; Min Operating Temperature: -30°C; Max Operating Temperature: 85°C; Orientation: Straight; Packaging: Rail/Tube; Series: ADE; Lead Free: Lead Free; Depth: 7.49mm; Flammability Rating: UL94 V-0; Radiation Hardening: No; Terminal Pitch: 2.54mm; Package Quantity: 35; Contact Material: Copper Alloy; Housing Color: Black; Number of Positions: 4; Length: 0.476inch; ELV: Compliant; Termination: PC Pins; Housing Material: Polyphenylene; Contact Plating: Gold; Max Current Rating: 100mA; Height: 0.138inch

## Nets that join several sheets
3V3: Power (C16.1 C17.2 U4.2 U4.4), asynchronous (6 pins)
+5: Power (5 pins), synchronous (C1.1 J4.5 R1.2 U1.7), Sensor_interfacing (P1.4 P4.4), Stepper_AZ (5 pins), Stepper_Alt (5 pins)
+12: Power (C9.1 C10.2 J3.1 U3.3), Stepper_AZ (C11A.1 P3A.8), Stepper_Alt (C11B.1 P3B.8)
GND: Power (16 pins), synchronous (14 pins), asynchronous (18 pins), Sensor_interfacing (P1.1 P4.3), Stepper_AZ (C11A.2 P3A.1 P3A.7), Stepper_Alt (C11B.2 P3B.1 P3B.7)
NetP1_2: synchronous (U1.5), Sensor_interfacing (P1.2)
NetP1_3: synchronous (U1.6), Sensor_interfacing (P1.3)
NetP2A_7: synchronous (U1.11), Stepper_AZ (P2A.7)
NetP2A_8: synchronous (U1.13), Stepper_AZ (P2A.8)
NetP2B_7: synchronous (U1.12), Stepper_Alt (P2B.7)
NetP2B_8: synchronous (U1.14), Stepper_Alt (P2B.8)
RX_channel: synchronous (U1.2), asynchronous (R8.1)
SCL: synchronous (J4.3 U1.28), Sensor_interfacing (P4.2)
SDA: synchronous (U1.27), Sensor_interfacing (P4.1)
TX_channel: synchronous (U1.3), asynchronous (R7.1)